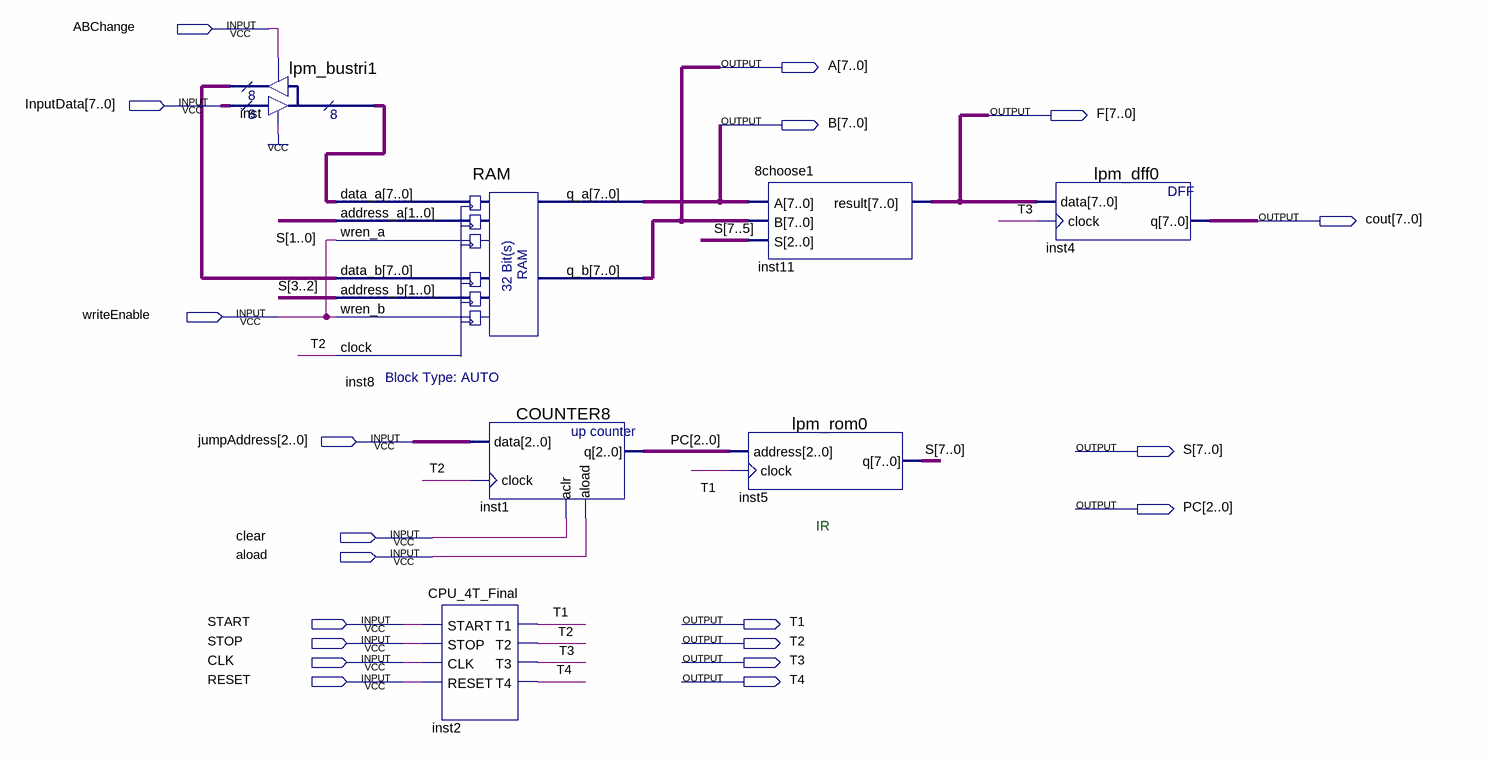
[diagram p0: schematic sheet]
// Quartus schematic CPU1.0.bdf as structural Verilog: 7 symbols, 20 pins
module \CPU1.0  (
  input  ABChange,
  input  [7:0] InputData,
  input  writeEnable,
  input  [2:0] jumpAddress,
  input  clear,
  input  aload,
  input  START,
  input  STOP,
  input  CLK,
  input  RESET,
  output [7:0] A,
  output [7:0] F,
  output [7:0] B,
  output [7:0] cout,
  output [7:0] S,
  output [2:0] PC,
  output T1,
  output T2,
  output T3,
  output T4
);

  wire [7:0] inst_result, inst_tridata;

  lpm_bustri1 inst (
    .enabledt(1'b1), .data(InputData), .enabletr(ABChange), .result(inst_result), .tridata(inst_tridata));
  RAM inst8 (
    .data_a(inst_tridata), .address_a(S[1:0]), .wren_a(writeEnable), .data_b(inst_result),
    .address_b(S[3:2]), .wren_b(writeEnable), .clock(T2), .q_a(B), .q_b(A));
  CPU_4T_Final inst2 (.START(START), .STOP(STOP), .CLK(CLK), .RESET(RESET), .T1(T1), .T2(T2), .T3(T3), .T4(T4));
  COUNTER8 inst1 (.data(jumpAddress), .clock(T2), .aclr(clear), .aload(aload), .q(PC));
  \8choose1  inst11 (.A(B), .B(A), .S(S[7:5]), .result(F));
  lpm_rom0 inst5 (.address(PC), .clock(T1), .q(S));
  lpm_dff0 inst4 (.data(F), .clock(T3), .q(cout));

  // Notes on the sheet:
  //   IR
endmodule
